# Altium project BIN_TO_BCD_MODULE.PrjPcb
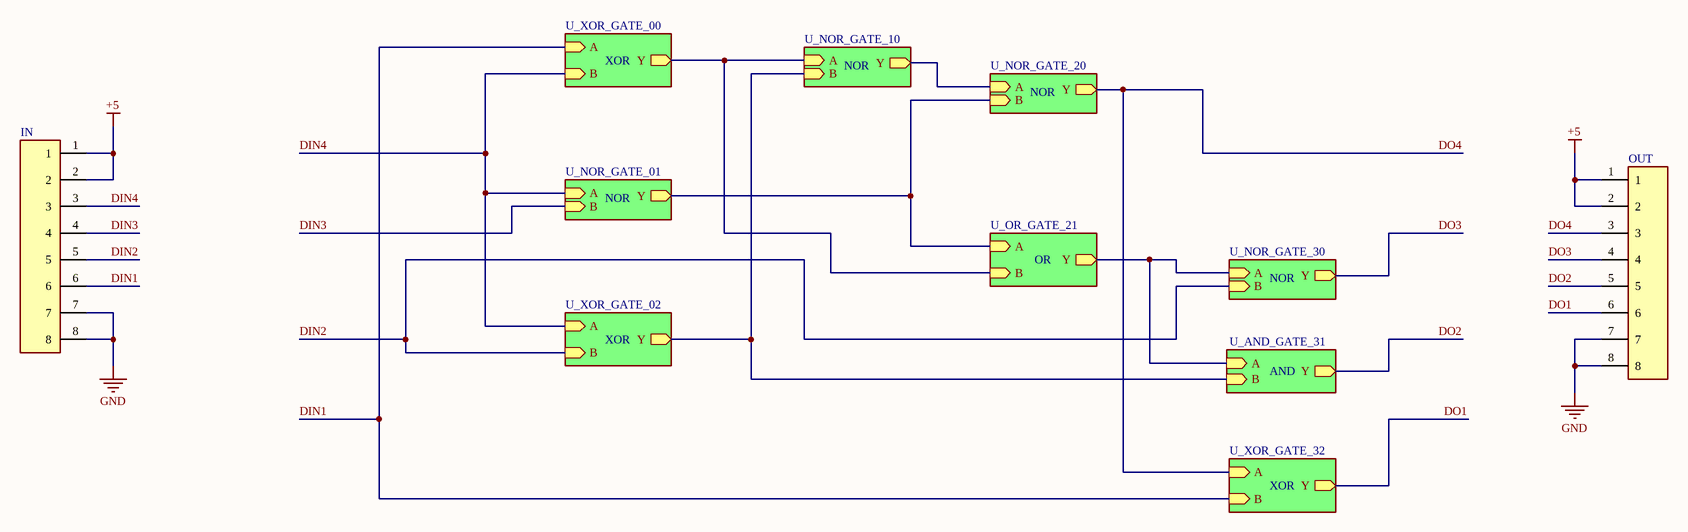
[diagram p0: MODULE_1.SchDoc]
6 sheets, 204 parts. Net scope: hierarchical (ports join the sheet entries above them; power ports are global).
Board files: PCB1.PcbDoc, PCB2.PcbDoc
Sheets:
  MODULE_1.SchDoc
    U_XOR_GATE_02 = XOR_GATE.SchDoc
    U_OR_GATE_21 = OR_GATE.SchDoc
    U_AND_GATE_31 = AND_GATE.SchDoc
    U_NOR_GATE_01 = NOR_GATE.SchDoc
    U_XOR_GATE_00 = XOR_GATE.SchDoc
    U_NOR_GATE_10 = NOR_GATE.SchDoc
    U_NOR_GATE_20 = NOR_GATE.SchDoc
    U_NOR_GATE_30 = NOR_GATE.SchDoc
    U_XOR_GATE_32 = XOR_GATE.SchDoc
  Sheet1.SchDoc

## Sheet MODULE_1.SchDoc
size B

### Parts
IN  2.54mm_TH_1x8_pin_header  [2.54mm_TH_1x8_pin_header]  (value not drawn)
OUT  2.54mm_TH_1x8_pin_header  [2.54mm_TH_1x8_pin_header]  (value not drawn)

### Sub-sheets
U_AND_GATE_31 = AND_GATE.SchDoc: Y (out), A (in), B (in)
U_NOR_GATE_01 = NOR_GATE.SchDoc: Y (out), A (in), B (in)
U_NOR_GATE_10 = NOR_GATE.SchDoc: Y (out), A (in), B (in)
U_NOR_GATE_20 = NOR_GATE.SchDoc: Y (out), A (in), B (in)
U_NOR_GATE_30 = NOR_GATE.SchDoc: Y (out), A (in), B (in)
U_OR_GATE_21 = OR_GATE.SchDoc: Y (out), A (in), B (in)
U_XOR_GATE_00 = XOR_GATE.SchDoc: Y (out), A (in), B (in)
U_XOR_GATE_02 = XOR_GATE.SchDoc: Y (out), A (in), B (in)
U_XOR_GATE_32 = XOR_GATE.SchDoc: Y (out), A (in), B (in)

### Nets
+5: IN.1 IN.2 OUT.1 OUT.2
GND: IN.7 IN.8 OUT.7 OUT.8
DIN1: IN.6 ; sheet U_XOR_GATE_00/A, sheet U_XOR_GATE_32/B
DIN2: IN.5 ; sheet U_XOR_GATE_02/B, sheet U_NOR_GATE_30/B
DIN3: IN.4 ; sheet U_NOR_GATE_01/B
DIN4: IN.3 ; sheet U_XOR_GATE_02/A, sheet U_NOR_GATE_01/A, sheet U_XOR_GATE_00/B
DO1: OUT.6 ; sheet U_XOR_GATE_32/Y
DO2: OUT.5 ; sheet U_AND_GATE_31/Y
DO3: OUT.4 ; sheet U_NOR_GATE_30/Y
DO4: OUT.3 ; sheet U_NOR_GATE_20/Y, sheet U_XOR_GATE_32/A
NetAIN_R1_2: sheet U_OR_GATE_21/Y, sheet U_AND_GATE_31/A, sheet U_NOR_GATE_30/A
NetAIN_R2_U_NOR_GATE_10_2: sheet U_OR_GATE_21/B, sheet U_XOR_GATE_00/Y, sheet U_NOR_GATE_10/A
NetAIN_R2_U_NOR_GATE_20_2: sheet U_NOR_GATE_10/Y, sheet U_NOR_GATE_20/A
NetAIN_R3_2: sheet U_OR_GATE_21/A, sheet U_NOR_GATE_01/Y, sheet U_NOR_GATE_20/B
NetBIN_R1_2: sheet U_XOR_GATE_02/Y, sheet U_AND_GATE_31/B, sheet U_NOR_GATE_10/B

### Notes on the sheet
- XOR
- NOR
- OR
- AND

### Library data of the parts
IN OUT = 2.54mm_TH_1x8_pin_header: System: Connector

## Sheet XOR_GATE.SchDoc
size A
Used 3 times, as channels U_XOR_GATE_02, U_XOR_GATE_00, U_XOR_GATE_32. Parts and nets are listed once, with the designators drawn on the sheet.
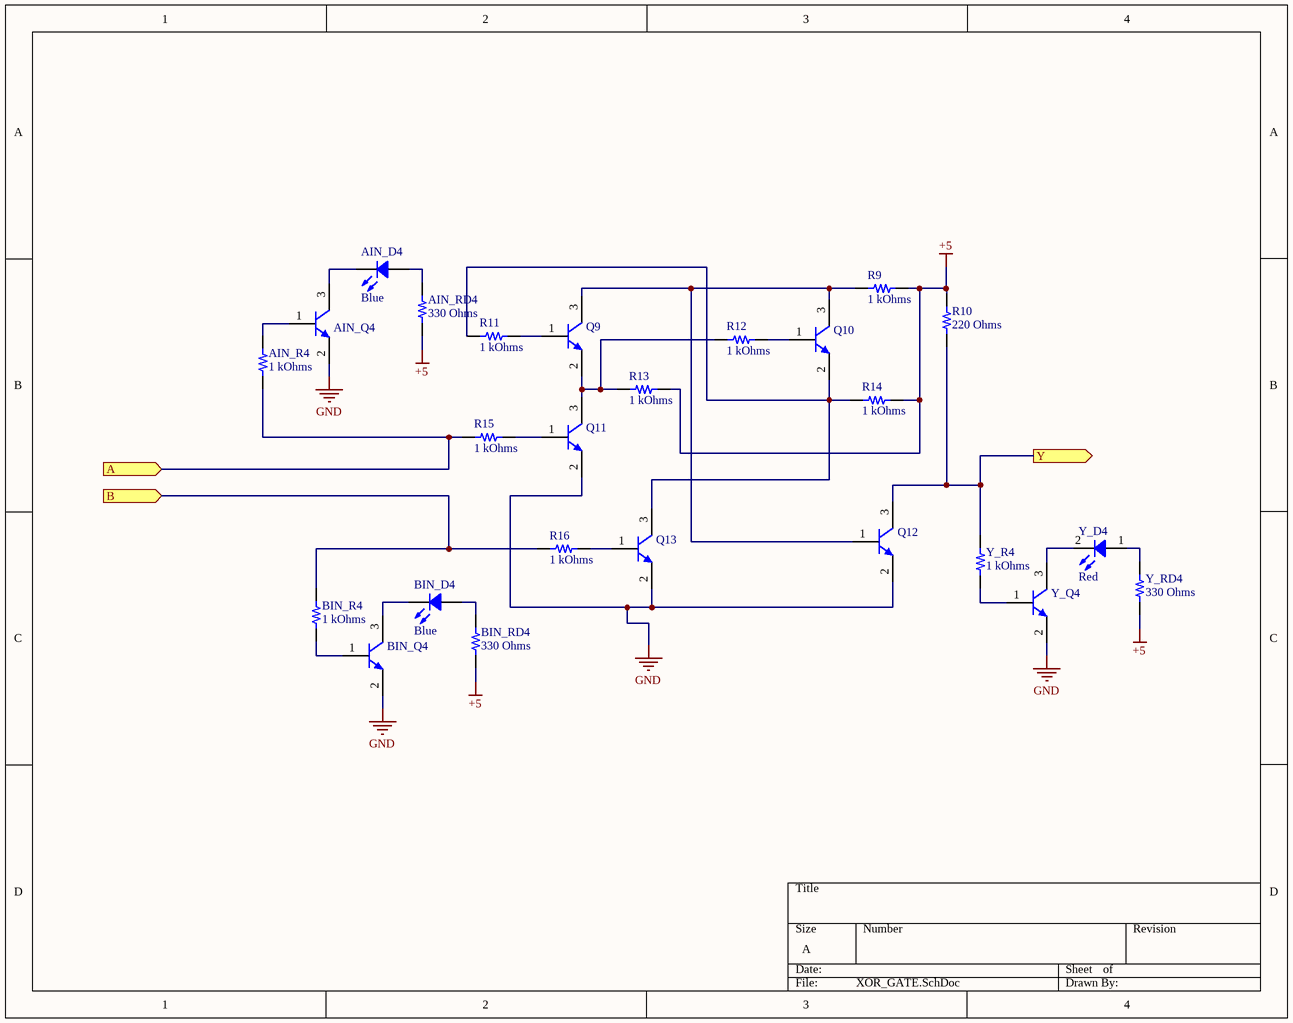
[diagram p1: XOR_GATE.SchDoc]

### Parts
AIN_D4  Blue  [LED 0603_1608 BLUE]
AIN_Q4  MMSS8050-L-TP  [MCCSEMI SOT-23-3]  (value not drawn)
AIN_R4  1 kOhms  [RES 0603_1608]
AIN_RD4  330 Ohms  [RES 0603_1608]
BIN_D4  Blue  [LED 0603_1608 BLUE]
BIN_Q4  MMSS8050-L-TP  [MCCSEMI SOT-23-3]  (value not drawn)
BIN_R4  1 kOhms  [RES 0603_1608]
BIN_RD4  330 Ohms  [RES 0603_1608]
Q9  MMSS8050-L-TP  [MCCSEMI SOT-23-3]  (value not drawn)
Q10  MMSS8050-L-TP  [MCCSEMI SOT-23-3]  (value not drawn)
Q11  MMSS8050-L-TP  [MCCSEMI SOT-23-3]  (value not drawn)
Q12  MMSS8050-L-TP  [MCCSEMI SOT-23-3]  (value not drawn)
Q13  MMSS8050-L-TP  [MCCSEMI SOT-23-3]  (value not drawn)
R9  1 kOhms  [RES 0603_1608]
R10  220 Ohms  [RES 0603_1608]
R11  1 kOhms  [RES 0603_1608]
R12  1 kOhms  [RES 0603_1608]
R13  1 kOhms  [RES 0603_1608]
R14  1 kOhms  [RES 0603_1608]
R15  1 kOhms  [RES 0603_1608]
R16  1 kOhms  [RES 0603_1608]
Y_D4  Red  [LED 0603_1608 RED]
Y_Q4  MMSS8050-L-TP  [MCCSEMI SOT-23-3]  (value not drawn)
Y_R4  1 kOhms  [RES 0603_1608]
Y_RD4  330 Ohms  [RES 0603_1608]

### Ports
A (in), B (in), Y (out)

### Nets
+5: AIN_RD4.1 BIN_RD4.1 R9.2 R10.2 R13.2 R14.2 Y_RD4.1
GND: AIN_Q4.2(E) BIN_Q4.2(E) Q11.2(E) Q12.2(E) Q13.2(E) Y_Q4.2(E)
A: AIN_R4.2 R15.1 ; port A
B: BIN_R4.2 R16.1 ; port B
Y: Q12.3(C) R10.1 Y_R4.2 ; port Y
NetAIN_D4_1: AIN_D4.1 AIN_RD4.2
NetAIN_D4_2: AIN_D4.2 AIN_Q4.3(C)
NetAIN_Q4_1: AIN_Q4.1(B) AIN_R4.1
NetBIN_D4_1: BIN_D4.1 BIN_RD4.2
NetBIN_D4_2: BIN_D4.2 BIN_Q4.3(C)
NetBIN_Q4_1: BIN_Q4.1(B) BIN_R4.1
NetQ9_1: Q9.1(B) R11.2
NetQ9_2: Q9.2(E) Q11.3(C) R12.1 R13.1
NetQ9_3: Q9.3(C) Q10.3(C) Q12.1(B) R9.1
NetQ10_1: Q10.1(B) R12.2
NetQ10_2: Q10.2(E) Q13.3(C) R11.1 R14.1
NetQ11_1: Q11.1(B) R15.2
NetQ13_1: Q13.1(B) R16.2
NetY_D4_1: Y_D4.1 Y_RD4.2
NetY_D4_2: Y_D4.2 Y_Q4.3(C)
NetY_Q4_1: Y_Q4.1(B) Y_R4.1

### Channels
U_XOR_GATE_02: designators end in _U_XOR_GATE_02; ports A=DIN4 B=DIN2 Y=NetBIN_R1_2
U_XOR_GATE_00: designators end in _U_XOR_GATE_00; ports A=DIN1 B=DIN4 Y=NetAIN_R2_U_NOR_GATE_10_2
U_XOR_GATE_32: designators end in _U_XOR_GATE_32; ports A=DO4 B=DIN1 Y=DO1

### Library data of the parts
AIN_D4 BIN_D4 = IN-S63AT5B: LED BLUE CLEAR 0603 SMD; Manufacturer: Inolux; Configuration: Standard; Current - Test: 5mA; Lens Size: 1.15mm x 0.80mm; Lens Style: Rectangle with Flat Top; Millicandela Rating: 45mcd; Viewing Angle: 120°; Voltage - Forward (Vf) (Typ): 2.8V; Wavelength - Dominant: 470nm; Wavelength - Peak: 468nm; Part Number: IN-S63AT5B; Color: Blue; ComponentLink1Description: Datasheet; ComponentLink1URL: http://www.inolux-corp.com/datasheet/SMDLED/Mono%20Color%20Top%20View/IN-S63AT%20Series_V1.1.pdf; ComponentLink2Description: DigiKey Link; ComponentLink2URL: https://www.digikey.com/en/products/detail/inolux/IN-S63AT5B/7604929; Device Package: 0603 (1608 Metric); Height (Max): 0.40mm; LastUpdated: 6/3/2024 7:57:52 PM; Lens Color: Clear; Lens Transparency: Clear; Lifecycle Status: Active; Minimum Order: 1; Mounting Type: Surface Mount; Package / Case: 0603 (1608 Metric); Packaging: TapeAndReel; PartId: 834; Part Status: Active; Price: 0.03; Series: IN-S63AT; Size / Dimension: 1.60mm L x 0.80mm W; Supplier 1: DigiKey; Supplier Part Number 1: 1830-1061-1-ND; Supplier Device Package: 0603; Value: Blue
AIN_Q4 BIN_Q4 Q9-Q13 Y_Q4 = MMSS8050-L-TP: TRANS NPN 25V 1.5A SOT23; Manufacturer: Micro Commercial Co; Current - Collector Cutoff (Max): 100nA; DC Current Gain (hFE) (Min) @ Ic, Vce: 120 @ 100mA, 1V; Frequency - Transition: 100MHz; Power - Max: 625 mW; Vce Saturation (Max) @ Ib, Ic: 500mV @ 80mA, 800mA; Part Number: MMSS8050-L-TP; ComponentLink1Description: Datasheet; ComponentLink1URL: https://www.mccsemi.com/pdf/Products/MMSS8050(SOT-23).pdf; ComponentLink2Description: DigiKey Link; ComponentLink2URL: https://www.digikey.com/en/products/detail/micro-commercial-co/MMSS8050-L-TP/2827197; Current - Collector (Ic) (Max): 1.5 A; LastUpdated: 6/3/2024 8:24:16 PM; Lifecycle Status: Active; Minimum Order: 1; Mounting Type: Surface Mount; Operating Temperature: -55°C ~ 150°C (TJ); Package / Case: TO-236-3, SC-59, SOT-23-3; Packaging: TapeAndReel; PartId: 278; Part Status: Active; Price: 0.01; Series: -; Supplier 1: DigiKey; Supplier Part Number 1: MMSS8050-L-TPMSCT-ND; Supplier Device Package: SOT-23; Transistor Type: NPN; Voltage - Collector Emitter Breakdown (Max): 25 V
AIN_R4 BIN_R4 R9 R11-R16 Y_R4 = CPF0603B1K0E: RES SMD 1K OHM 0.1% 1/16W 0603; Manufacturer: TE Connectivity Passive Product; Power (Watts): 0.063W, 1/16W; Temperature Coefficient: ±25ppm/°C; Part Number: CPF0603B1K0E; Value: 1 kOhms; ComponentLink1Description: Datasheet; ComponentLink1URL: https://www.te.com/commerce/DocumentDelivery/DDEController?Action=srchrtrv&DocNm=1773200&DocType=DS&DocLang=English; ComponentLink2Description: DigiKey Link; ComponentLink2URL: https://www.digikey.com/en/products/detail/te-connectivity-passive-product/CPF0603B1K0E/2390473; Composition: Thin Film; Device Package: 0603 (1608 Metric); Height - Seated (Max): 0.022" (0.55mm); LastUpdated: 2/9/2024 8:43:37 PM; Lifecycle Status: Active; Minimum Order: 1; Number of Terminations: 2; Operating Temperature: -55°C ~ 155°C; Package / Case: 0603 (1608 Metric); Packaging: TapeAndReel; PartId: 4877; Part Status: Active; Price: 0.09; Resistance: 1 kOhms; Series: CPF, Neohm; Size / Dimension: 0.061" L x 0.031" W (1.55mm x 0.80mm); Supplier 1: DigiKey; Supplier Part Number 1: A119887CT-ND; Supplier Device Package: 0603; Tolerance: ±0.1%
AIN_RD4 BIN_RD4 Y_RD4 = RMCF0603JT330R: RES 330 OHM 5% 1/10W 0603; Manufacturer: Stackpole Electronics Inc; Power (Watts): 0.1W, 1/10W; Temperature Coefficient: ±200ppm/°C; Part Number: RMCF0603JT330R; Value: 330 Ohms; ComponentLink1Description: Datasheet; ComponentLink1URL: https://www.seielect.com/catalog/sei-rmcf_rmcp.pdf; ComponentLink2Description: DigiKey Link; ComponentLink2URL: https://www.digikey.com/en/products/detail/stackpole-electronics-inc/RMCF0603JT330R/1757998; Composition: Thick Film; Device Package: 0603 (1608 Metric); Features: Automotive AEC-Q200; Height - Seated (Max): 0.022" (0.55mm); LastUpdated: 2/9/2024 8:43:33 PM; Lifecycle Status: Active; Minimum Order: 1; Number of Terminations: 2; Operating Temperature: -55°C ~ 155°C; Package / Case: 0603 (1608 Metric); Packaging: CutTape; PartId: 5841; Part Status: Active; Price: 0.01; Ratings: AEC-Q200; Resistance: 330 Ohms; Series: RMCF; Size / Dimension: 0.061" L x 0.031" W (1.55mm x 0.80mm); Supplier 1: DigiKey; Supplier Part Number 1: RMCF0603JT330RCT-ND; Supplier Device Package: 0603; Tolerance: ±5%
R10 = ERA-3AED221V: RES SMD 220 OHM 0.5% 1/10W 0603; Manufacturer: Panasonic Electronic Components; Power (Watts): 0.1W, 1/10W; Temperature Coefficient: ±25ppm/°C; Part Number: ERA-3AED221V; Value: 220 Ohms; ComponentLink1Description: Datasheet; ComponentLink1URL: https://industrial.panasonic.com/cdbs/www-data/pdf/RDM0000/AOA0000C307.pdf; ComponentLink2Description: DigiKey Link; ComponentLink2URL: https://www.digikey.com/en/products/detail/panasonic-electronic-components/ERA-3AED221V/9373509; Composition: Thin Film; Device Package: 0603 (1608 Metric); Features: Automotive AEC-Q200; Height - Seated (Max): 0.022" (0.55mm); LastUpdated: 2/9/2024 8:43:36 PM; Lifecycle Status: Active; Minimum Order: 1; Number of Terminations: 2; Operating Temperature: -55°C ~ 155°C; Package / Case: 0603 (1608 Metric); Packaging: TapeAndReel; PartId: 4952; Part Status: Active; Price: 0.03; Ratings: AEC-Q200; Resistance: 220 Ohms; Series: ERA-3A; Size / Dimension: 0.063" L x 0.031" W (1.60mm x 0.80mm); Supplier 1: DigiKey; Supplier Part Number 1: P123752CT-ND; Supplier Device Package: 0603; Tolerance: ±0.5%
Y_D4 = XZMDK53W-8: LED RED CLEAR CHIP SMD; Manufacturer: SunLED; Configuration: Standard; Current - Test: 20mA; Lens Color: Colorless; Lens Size: 0.35mm Dia; Lens Style: Round with Domed Top; Millicandela Rating: 248mcd; Viewing Angle: 60°; Voltage - Forward (Vf) (Typ): 1.95V; Wavelength - Dominant: 630nm; Wavelength - Peak: 645nm; Part Number: XZMDK53W-8; Color: Red; ComponentLink1Description: Datasheet; ComponentLink1URL: https://www.sunledusa.com/products/spec/XZMDK53W-8.pdf; ComponentLink2Description: DigiKey Link; ComponentLink2URL: https://www.digikey.com/en/products/detail/sunled/XZMDK53W-8/4745952; Device Package: 0603 (1608 Metric); Height (Max): 0.95mm; LastUpdated: 6/3/2024 7:59:48 PM; Lens Transparency: Clear; Lifecycle Status: Active; Minimum Order: 1; Mounting Type: Surface Mount; Package / Case: 0603 (1608 Metric); Packaging: TapeAndReel; PartId: 401; Part Status: Active; Price: 0.06; Series: PixsoLED; Size / Dimension: 1.60mm L x 0.80mm W; Supplier 1: DigiKey; Supplier Part Number 1: 1497-1169-6-ND; Supplier Device Package: Chip LED; Value: Red

## Sheet OR_GATE.SchDoc
size A
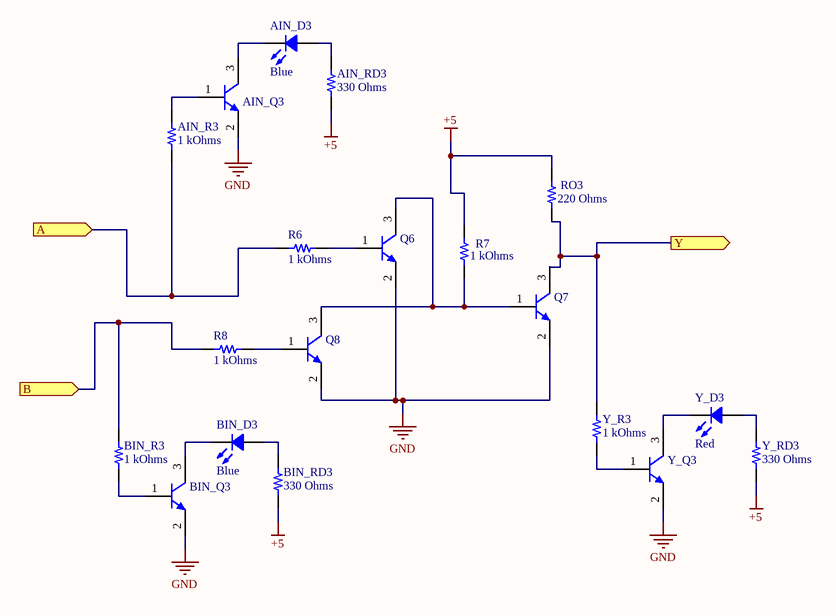
[diagram p2: OR_GATE.SchDoc]

### Parts
AIN_D3  Blue  [LED 0603_1608 BLUE]
AIN_Q3  MMSS8050-L-TP  [MCCSEMI SOT-23-3]  (value not drawn)
AIN_R3  1 kOhms  [RES 0603_1608]
AIN_RD3  330 Ohms  [RES 0603_1608]
BIN_D3  Blue  [LED 0603_1608 BLUE]
BIN_Q3  MMSS8050-L-TP  [MCCSEMI SOT-23-3]  (value not drawn)
BIN_R3  1 kOhms  [RES 0603_1608]
BIN_RD3  330 Ohms  [RES 0603_1608]
Q6  MMSS8050-L-TP  [MCCSEMI SOT-23-3]  (value not drawn)
Q7  MMSS8050-L-TP  [MCCSEMI SOT-23-3]  (value not drawn)
Q8  MMSS8050-L-TP  [MCCSEMI SOT-23-3]  (value not drawn)
R6  1 kOhms  [RES 0603_1608]
R7  1 kOhms  [RES 0603_1608]
R8  1 kOhms  [RES 0603_1608]
RO3  220 Ohms  [RES 0603_1608]
Y_D3  Red  [LED 0603_1608 RED]
Y_Q3  MMSS8050-L-TP  [MCCSEMI SOT-23-3]  (value not drawn)
Y_R3  1 kOhms  [RES 0603_1608]
Y_RD3  330 Ohms  [RES 0603_1608]

### Ports
A (in), B (in), Y (out)

### Nets
+5: AIN_RD3.1 BIN_RD3.1 R7.2 RO3.2 Y_RD3.1
GND: AIN_Q3.2(E) BIN_Q3.2(E) Q6.2(E) Q7.2(E) Q8.2(E) Y_Q3.2(E)
NetAIN_D3_1: AIN_D3.1 AIN_RD3.2
NetAIN_D3_2: AIN_D3.2 AIN_Q3.3(C)
NetAIN_Q3_1: AIN_Q3.1(B) AIN_R3.1
NetAIN_R1_2: Q7.3(C) RO3.1 Y_R3.2 ; port Y
NetAIN_R2_U_NOR_GATE_10_2: BIN_R3.2 R8.1 ; port B
NetAIN_R3_2: AIN_R3.2 R6.1 ; port A
NetBIN_D3_1: BIN_D3.1 BIN_RD3.2
NetBIN_D3_2: BIN_D3.2 BIN_Q3.3(C)
NetBIN_Q3_1: BIN_Q3.1(B) BIN_R3.1
NetQ6_1: Q6.1(B) R6.2
NetQ6_3: Q6.3(C) Q7.1(B) Q8.3(C) R7.1
NetQ8_1: Q8.1(B) R8.2
NetY_D3_1: Y_D3.1 Y_RD3.2
NetY_D3_2: Y_D3.2 Y_Q3.3(C)
NetY_Q3_1: Y_Q3.1(B) Y_R3.1

### Library data of the parts
AIN_D3 BIN_D3 = IN-S63AT5B: as AIN_D4 on sheet XOR_GATE; Part Number: IN-S63AT5B; Color: Blue; ComponentLink1Description: Datasheet; ComponentLink1URL: http://www.inolux-corp.com/datasheet/SMDLED/Mono%20Color%20Top%20View/IN-S63AT%20Series_V1.1.pdf; ComponentLink2Description: DigiKey Link; ComponentLink2URL: https://www.digikey.com/en/products/detail/inolux/IN-S63AT5B/7604929; Device Package: 0603 (1608 Metric); Height (Max): 0.40mm; LastUpdated: 6/3/2024 7:57:52 PM; Lens Color: Clear; Lens Transparency: Clear; Lifecycle Status: Active; Minimum Order: 1; Mounting Type: Surface Mount; Package / Case: 0603 (1608 Metric); Packaging: TapeAndReel; PartId: 834; Part Status: Active; Price: 0.03; Series: IN-S63AT; Size / Dimension: 1.60mm L x 0.80mm W; Supplier 1: DigiKey; Supplier Part Number 1: 1830-1061-1-ND; Supplier Device Package: 0603; Value: Blue
AIN_Q3 BIN_Q3 Q6-Q8 Y_Q3 = MMSS8050-L-TP: as AIN_Q4 on sheet XOR_GATE; Part Number: MMSS8050-L-TP; ComponentLink1Description: Datasheet; ComponentLink1URL: https://www.mccsemi.com/pdf/Products/MMSS8050(SOT-23).pdf; ComponentLink2Description: DigiKey Link; ComponentLink2URL: https://www.digikey.com/en/products/detail/micro-commercial-co/MMSS8050-L-TP/2827197; Current - Collector (Ic) (Max): 1.5 A; LastUpdated: 6/3/2024 8:24:16 PM; Lifecycle Status: Active; Minimum Order: 1; Mounting Type: Surface Mount; Operating Temperature: -55°C ~ 150°C (TJ); Package / Case: TO-236-3, SC-59, SOT-23-3; Packaging: TapeAndReel; PartId: 278; Part Status: Active; Price: 0.01; Series: -; Supplier 1: DigiKey; Supplier Part Number 1: MMSS8050-L-TPMSCT-ND; Supplier Device Package: SOT-23; Transistor Type: NPN; Voltage - Collector Emitter Breakdown (Max): 25 V
AIN_R3 BIN_R3 R6-R8 Y_R3 = CPF0603B1K0E: as AIN_R4 on sheet XOR_GATE; Part Number: CPF0603B1K0E; Value: 1 kOhms; ComponentLink1Description: Datasheet; ComponentLink1URL: https://www.te.com/commerce/DocumentDelivery/DDEController?Action=srchrtrv&DocNm=1773200&DocType=DS&DocLang=English; ComponentLink2Description: DigiKey Link; ComponentLink2URL: https://www.digikey.com/en/products/detail/te-connectivity-passive-product/CPF0603B1K0E/2390473; Composition: Thin Film; Device Package: 0603 (1608 Metric); Height - Seated (Max): 0.022" (0.55mm); LastUpdated: 2/9/2024 8:43:37 PM; Lifecycle Status: Active; Minimum Order: 1; Number of Terminations: 2; Operating Temperature: -55°C ~ 155°C; Package / Case: 0603 (1608 Metric); Packaging: TapeAndReel; PartId: 4877; Part Status: Active; Price: 0.09; Resistance: 1 kOhms; Series: CPF, Neohm; Size / Dimension: 0.061" L x 0.031" W (1.55mm x 0.80mm); Supplier 1: DigiKey; Supplier Part Number 1: A119887CT-ND; Supplier Device Package: 0603; Tolerance: ±0.1%
AIN_RD3 BIN_RD3 Y_RD3 = RMCF0603JT330R: as AIN_RD4 on sheet XOR_GATE; Part Number: RMCF0603JT330R; Value: 330 Ohms; ComponentLink1Description: Datasheet; ComponentLink1URL: https://www.seielect.com/catalog/sei-rmcf_rmcp.pdf; ComponentLink2Description: DigiKey Link; ComponentLink2URL: https://www.digikey.com/en/products/detail/stackpole-electronics-inc/RMCF0603JT330R/1757998; Composition: Thick Film; Device Package: 0603 (1608 Metric); Features: Automotive AEC-Q200; Height - Seated (Max): 0.022" (0.55mm); LastUpdated: 2/9/2024 8:43:33 PM; Lifecycle Status: Active; Minimum Order: 1; Number of Terminations: 2; Operating Temperature: -55°C ~ 155°C; Package / Case: 0603 (1608 Metric); Packaging: CutTape; PartId: 5841; Part Status: Active; Price: 0.01; Ratings: AEC-Q200; Resistance: 330 Ohms; Series: RMCF; Size / Dimension: 0.061" L x 0.031" W (1.55mm x 0.80mm); Supplier 1: DigiKey; Supplier Part Number 1: RMCF0603JT330RCT-ND; Supplier Device Package: 0603; Tolerance: ±5%
RO3 = ERA-3AED221V: as R10 on sheet XOR_GATE; Part Number: ERA-3AED221V; Value: 220 Ohms; ComponentLink1Description: Datasheet; ComponentLink1URL: https://industrial.panasonic.com/cdbs/www-data/pdf/RDM0000/AOA0000C307.pdf; ComponentLink2Description: DigiKey Link; ComponentLink2URL: https://www.digikey.com/en/products/detail/panasonic-electronic-components/ERA-3AED221V/9373509; Composition: Thin Film; Device Package: 0603 (1608 Metric); Features: Automotive AEC-Q200; Height - Seated (Max): 0.022" (0.55mm); LastUpdated: 2/9/2024 8:43:36 PM; Lifecycle Status: Active; Minimum Order: 1; Number of Terminations: 2; Operating Temperature: -55°C ~ 155°C; Package / Case: 0603 (1608 Metric); Packaging: TapeAndReel; PartId: 4952; Part Status: Active; Price: 0.03; Ratings: AEC-Q200; Resistance: 220 Ohms; Series: ERA-3A; Size / Dimension: 0.063" L x 0.031" W (1.60mm x 0.80mm); Supplier 1: DigiKey; Supplier Part Number 1: P123752CT-ND; Supplier Device Package: 0603; Tolerance: ±0.5%
Y_D3 = XZMDK53W-8: as Y_D4 on sheet XOR_GATE; Part Number: XZMDK53W-8; Color: Red; ComponentLink1Description: Datasheet; ComponentLink1URL: https://www.sunledusa.com/products/spec/XZMDK53W-8.pdf; ComponentLink2Description: DigiKey Link; ComponentLink2URL: https://www.digikey.com/en/products/detail/sunled/XZMDK53W-8/4745952; Device Package: 0603 (1608 Metric); Height (Max): 0.95mm; LastUpdated: 6/3/2024 7:59:48 PM; Lens Transparency: Clear; Lifecycle Status: Active; Minimum Order: 1; Mounting Type: Surface Mount; Package / Case: 0603 (1608 Metric); Packaging: TapeAndReel; PartId: 401; Part Status: Active; Price: 0.06; Series: PixsoLED; Size / Dimension: 1.60mm L x 0.80mm W; Supplier 1: DigiKey; Supplier Part Number 1: 1497-1169-6-ND; Supplier Device Package: Chip LED; Value: Red

## Sheet AND_GATE.SchDoc
size A
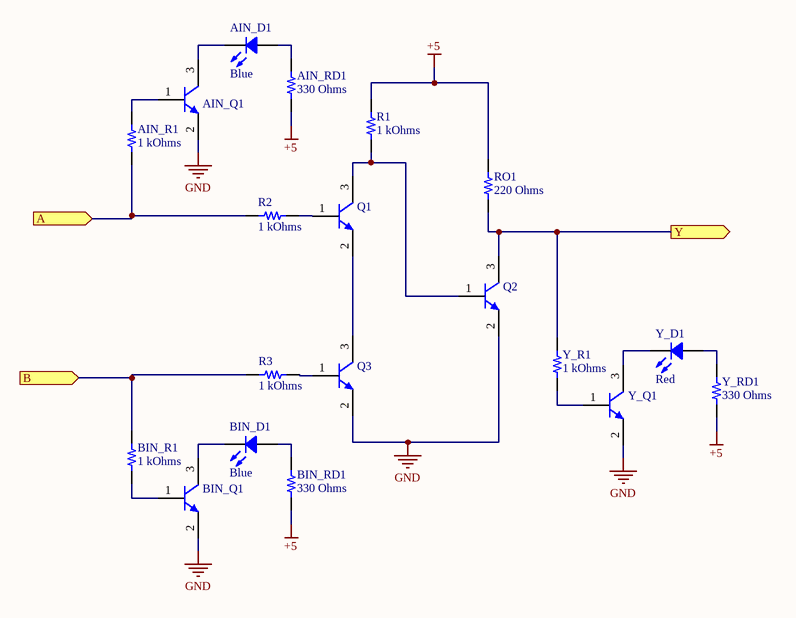
[diagram p3: AND_GATE.SchDoc]

### Parts
AIN_D1  Blue  [LED 0603_1608 BLUE]
AIN_Q1  MMSS8050-L-TP  [MCCSEMI SOT-23-3]  (value not drawn)
AIN_R1  1 kOhms  [RES 0603_1608]
AIN_RD1  330 Ohms  [RES 0603_1608]
BIN_D1  Blue  [LED 0603_1608 BLUE]
BIN_Q1  MMSS8050-L-TP  [MCCSEMI SOT-23-3]  (value not drawn)
BIN_R1  1 kOhms  [RES 0603_1608]
BIN_RD1  330 Ohms  [RES 0603_1608]
Q1  MMSS8050-L-TP  [MCCSEMI SOT-23-3]  (value not drawn)
Q2  MMSS8050-L-TP  [MCCSEMI SOT-23-3]  (value not drawn)
Q3  MMSS8050-L-TP  [MCCSEMI SOT-23-3]  (value not drawn)
R1  1 kOhms  [RES 0603_1608]
R2  1 kOhms  [RES 0603_1608]
R3  1 kOhms  [RES 0603_1608]
RO1  220 Ohms  [RES 0603_1608]
Y_D1  Red  [LED 0603_1608 RED]
Y_Q1  MMSS8050-L-TP  [MCCSEMI SOT-23-3]  (value not drawn)
Y_R1  1 kOhms  [RES 0603_1608]
Y_RD1  330 Ohms  [RES 0603_1608]

### Ports
A (in), B (in), Y (out)

### Nets
+5: AIN_RD1.1 BIN_RD1.1 R1.2 RO1.2 Y_RD1.1
GND: AIN_Q1.2(E) BIN_Q1.2(E) Q2.2(E) Q3.2(E) Y_Q1.2(E)
DO2: Q2.3(C) RO1.1 Y_R1.2 ; port Y
NetAIN_D1_1: AIN_D1.1 AIN_RD1.2
NetAIN_D1_2: AIN_D1.2 AIN_Q1.3(C)
NetAIN_Q1_1: AIN_Q1.1(B) AIN_R1.1
NetAIN_R1_2: AIN_R1.2 R2.1 ; port A
NetBIN_D1_1: BIN_D1.1 BIN_RD1.2
NetBIN_D1_2: BIN_D1.2 BIN_Q1.3(C)
NetBIN_Q1_1: BIN_Q1.1(B) BIN_R1.1
NetBIN_R1_2: BIN_R1.2 R3.1 ; port B
NetQ1_1: Q1.1(B) R2.2
NetQ1_2: Q1.2(E) Q3.3(C)
NetQ1_3: Q1.3(C) Q2.1(B) R1.1
NetQ3_1: Q3.1(B) R3.2
NetY_D1_1: Y_D1.1 Y_RD1.2
NetY_D1_2: Y_D1.2 Y_Q1.3(C)
NetY_Q1_1: Y_Q1.1(B) Y_R1.1

### Library data of the parts
AIN_D1 BIN_D1 = IN-S63AT5B: as AIN_D4 on sheet XOR_GATE; Part Number: IN-S63AT5B; Color: Blue; ComponentLink1Description: Datasheet; ComponentLink1URL: http://www.inolux-corp.com/datasheet/SMDLED/Mono%20Color%20Top%20View/IN-S63AT%20Series_V1.1.pdf; ComponentLink2Description: DigiKey Link; ComponentLink2URL: https://www.digikey.com/en/products/detail/inolux/IN-S63AT5B/7604929; Device Package: 0603 (1608 Metric); Height (Max): 0.40mm; LastUpdated: 6/3/2024 7:57:52 PM; Lens Color: Clear; Lens Transparency: Clear; Lifecycle Status: Active; Minimum Order: 1; Mounting Type: Surface Mount; Package / Case: 0603 (1608 Metric); Packaging: TapeAndReel; PartId: 834; Part Status: Active; Price: 0.03; Series: IN-S63AT; Size / Dimension: 1.60mm L x 0.80mm W; Supplier 1: DigiKey; Supplier Part Number 1: 1830-1061-1-ND; Supplier Device Package: 0603; Value: Blue
AIN_Q1 BIN_Q1 Q1-Q3 Y_Q1 = MMSS8050-L-TP: as AIN_Q4 on sheet XOR_GATE; Part Number: MMSS8050-L-TP; ComponentLink1Description: Datasheet; ComponentLink1URL: https://www.mccsemi.com/pdf/Products/MMSS8050(SOT-23).pdf; ComponentLink2Description: DigiKey Link; ComponentLink2URL: https://www.digikey.com/en/products/detail/micro-commercial-co/MMSS8050-L-TP/2827197; Current - Collector (Ic) (Max): 1.5 A; LastUpdated: 6/3/2024 8:24:16 PM; Lifecycle Status: Active; Minimum Order: 1; Mounting Type: Surface Mount; Operating Temperature: -55°C ~ 150°C (TJ); Package / Case: TO-236-3, SC-59, SOT-23-3; Packaging: TapeAndReel; PartId: 278; Part Status: Active; Price: 0.01; Series: -; Supplier 1: DigiKey; Supplier Part Number 1: MMSS8050-L-TPMSCT-ND; Supplier Device Package: SOT-23; Transistor Type: NPN; Voltage - Collector Emitter Breakdown (Max): 25 V
AIN_R1 BIN_R1 R1-R3 Y_R1 = CPF0603B1K0E: as AIN_R4 on sheet XOR_GATE; Part Number: CPF0603B1K0E; Value: 1 kOhms; ComponentLink1Description: Datasheet; ComponentLink1URL: https://www.te.com/commerce/DocumentDelivery/DDEController?Action=srchrtrv&DocNm=1773200&DocType=DS&DocLang=English; ComponentLink2Description: DigiKey Link; ComponentLink2URL: https://www.digikey.com/en/products/detail/te-connectivity-passive-product/CPF0603B1K0E/2390473; Composition: Thin Film; Device Package: 0603 (1608 Metric); Height - Seated (Max): 0.022" (0.55mm); LastUpdated: 2/9/2024 8:43:37 PM; Lifecycle Status: Active; Minimum Order: 1; Number of Terminations: 2; Operating Temperature: -55°C ~ 155°C; Package / Case: 0603 (1608 Metric); Packaging: TapeAndReel; PartId: 4877; Part Status: Active; Price: 0.09; Resistance: 1 kOhms; Series: CPF, Neohm; Size / Dimension: 0.061" L x 0.031" W (1.55mm x 0.80mm); Supplier 1: DigiKey; Supplier Part Number 1: A119887CT-ND; Supplier Device Package: 0603; Tolerance: ±0.1%
AIN_RD1 BIN_RD1 Y_RD1 = RMCF0603JT330R: as AIN_RD4 on sheet XOR_GATE; Part Number: RMCF0603JT330R; Value: 330 Ohms; ComponentLink1Description: Datasheet; ComponentLink1URL: https://www.seielect.com/catalog/sei-rmcf_rmcp.pdf; ComponentLink2Description: DigiKey Link; ComponentLink2URL: https://www.digikey.com/en/products/detail/stackpole-electronics-inc/RMCF0603JT330R/1757998; Composition: Thick Film; Device Package: 0603 (1608 Metric); Features: Automotive AEC-Q200; Height - Seated (Max): 0.022" (0.55mm); LastUpdated: 2/9/2024 8:43:33 PM; Lifecycle Status: Active; Minimum Order: 1; Number of Terminations: 2; Operating Temperature: -55°C ~ 155°C; Package / Case: 0603 (1608 Metric); Packaging: CutTape; PartId: 5841; Part Status: Active; Price: 0.01; Ratings: AEC-Q200; Resistance: 330 Ohms; Series: RMCF; Size / Dimension: 0.061" L x 0.031" W (1.55mm x 0.80mm); Supplier 1: DigiKey; Supplier Part Number 1: RMCF0603JT330RCT-ND; Supplier Device Package: 0603; Tolerance: ±5%
RO1 = ERA-3AED221V: as R10 on sheet XOR_GATE; Part Number: ERA-3AED221V; Value: 220 Ohms; ComponentLink1Description: Datasheet; ComponentLink1URL: https://industrial.panasonic.com/cdbs/www-data/pdf/RDM0000/AOA0000C307.pdf; ComponentLink2Description: DigiKey Link; ComponentLink2URL: https://www.digikey.com/en/products/detail/panasonic-electronic-components/ERA-3AED221V/9373509; Composition: Thin Film; Device Package: 0603 (1608 Metric); Features: Automotive AEC-Q200; Height - Seated (Max): 0.022" (0.55mm); LastUpdated: 2/9/2024 8:43:36 PM; Lifecycle Status: Active; Minimum Order: 1; Number of Terminations: 2; Operating Temperature: -55°C ~ 155°C; Package / Case: 0603 (1608 Metric); Packaging: TapeAndReel; PartId: 4952; Part Status: Active; Price: 0.03; Ratings: AEC-Q200; Resistance: 220 Ohms; Series: ERA-3A; Size / Dimension: 0.063" L x 0.031" W (1.60mm x 0.80mm); Supplier 1: DigiKey; Supplier Part Number 1: P123752CT-ND; Supplier Device Package: 0603; Tolerance: ±0.5%
Y_D1 = XZMDK53W-8: as Y_D4 on sheet XOR_GATE; Part Number: XZMDK53W-8; Color: Red; ComponentLink1Description: Datasheet; ComponentLink1URL: https://www.sunledusa.com/products/spec/XZMDK53W-8.pdf; ComponentLink2Description: DigiKey Link; ComponentLink2URL: https://www.digikey.com/en/products/detail/sunled/XZMDK53W-8/4745952; Device Package: 0603 (1608 Metric); Height (Max): 0.95mm; LastUpdated: 6/3/2024 7:59:48 PM; Lens Transparency: Clear; Lifecycle Status: Active; Minimum Order: 1; Mounting Type: Surface Mount; Package / Case: 0603 (1608 Metric); Packaging: TapeAndReel; PartId: 401; Part Status: Active; Price: 0.06; Series: PixsoLED; Size / Dimension: 1.60mm L x 0.80mm W; Supplier 1: DigiKey; Supplier Part Number 1: 1497-1169-6-ND; Supplier Device Package: Chip LED; Value: Red

## Sheet NOR_GATE.SchDoc
size A
Used 4 times, as channels U_NOR_GATE_01, U_NOR_GATE_10, U_NOR_GATE_20, U_NOR_GATE_30. Parts and nets are listed once, with the designators drawn on the sheet.
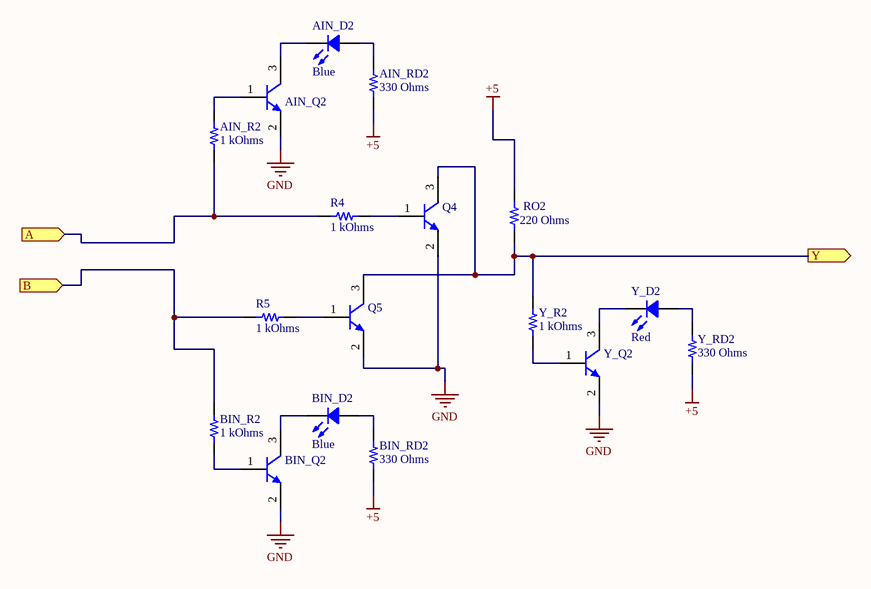
[diagram p4: NOR_GATE.SchDoc]

### Parts
AIN_D2  Blue  [LED 0603_1608 BLUE]
AIN_Q2  MMSS8050-L-TP  [MCCSEMI SOT-23-3]  (value not drawn)
AIN_R2  1 kOhms  [RES 0603_1608]
AIN_RD2  330 Ohms  [RES 0603_1608]
BIN_D2  Blue  [LED 0603_1608 BLUE]
BIN_Q2  MMSS8050-L-TP  [MCCSEMI SOT-23-3]  (value not drawn)
BIN_R2  1 kOhms  [RES 0603_1608]
BIN_RD2  330 Ohms  [RES 0603_1608]
Q4  MMSS8050-L-TP  [MCCSEMI SOT-23-3]  (value not drawn)
Q5  MMSS8050-L-TP  [MCCSEMI SOT-23-3]  (value not drawn)
R4  1 kOhms  [RES 0603_1608]
R5  1 kOhms  [RES 0603_1608]
RO2  220 Ohms  [RES 0603_1608]
Y_D2  Red  [LED 0603_1608 RED]
Y_Q2  MMSS8050-L-TP  [MCCSEMI SOT-23-3]  (value not drawn)
Y_R2  1 kOhms  [RES 0603_1608]
Y_RD2  330 Ohms  [RES 0603_1608]

### Ports
A (in), B (in), Y (out)

### Nets
+5: AIN_RD2.1 BIN_RD2.1 RO2.2 Y_RD2.1
GND: AIN_Q2.2(E) BIN_Q2.2(E) Q4.2(E) Q5.2(E) Y_Q2.2(E)
A: AIN_R2.2 R4.1 ; port A
B: BIN_R2.2 R5.1 ; port B
Y: Q4.3(C) Q5.3(C) RO2.1 Y_R2.2 ; port Y
NetAIN_D2_1: AIN_D2.1 AIN_RD2.2
NetAIN_D2_2: AIN_D2.2 AIN_Q2.3(C)
NetAIN_Q2_1: AIN_Q2.1(B) AIN_R2.1
NetBIN_D2_1: BIN_D2.1 BIN_RD2.2
NetBIN_D2_2: BIN_D2.2 BIN_Q2.3(C)
NetBIN_Q2_1: BIN_Q2.1(B) BIN_R2.1
NetQ4_1: Q4.1(B) R4.2
NetQ5_1: Q5.1(B) R5.2
NetY_D2_1: Y_D2.1 Y_RD2.2
NetY_D2_2: Y_D2.2 Y_Q2.3(C)
NetY_Q2_1: Y_Q2.1(B) Y_R2.1

### Channels
U_NOR_GATE_01: designators end in _U_NOR_GATE_01; ports A=DIN4 B=DIN3 Y=NetAIN_R3_2
U_NOR_GATE_10: designators end in _U_NOR_GATE_10; ports A=NetAIN_R2_U_NOR_GATE_10_2 B=NetBIN_R1_2 Y=NetAIN_R2_U_NOR_GATE_20_2
U_NOR_GATE_20: designators end in _U_NOR_GATE_20; ports A=NetAIN_R2_U_NOR_GATE_20_2 B=NetAIN_R3_2 Y=DO4
U_NOR_GATE_30: designators end in _U_NOR_GATE_30; ports A=NetAIN_R1_2 B=DIN2 Y=DO3

### Library data of the parts
AIN_D2 BIN_D2 = IN-S63AT5B: as AIN_D4 on sheet XOR_GATE; Part Number: IN-S63AT5B; Color: Blue; ComponentLink1Description: Datasheet; ComponentLink1URL: http://www.inolux-corp.com/datasheet/SMDLED/Mono%20Color%20Top%20View/IN-S63AT%20Series_V1.1.pdf; ComponentLink2Description: DigiKey Link; ComponentLink2URL: https://www.digikey.com/en/products/detail/inolux/IN-S63AT5B/7604929; Device Package: 0603 (1608 Metric); Height (Max): 0.40mm; LastUpdated: 6/3/2024 7:57:52 PM; Lens Color: Clear; Lens Transparency: Clear; Lifecycle Status: Active; Minimum Order: 1; Mounting Type: Surface Mount; Package / Case: 0603 (1608 Metric); Packaging: TapeAndReel; PartId: 834; Part Status: Active; Price: 0.03; Series: IN-S63AT; Size / Dimension: 1.60mm L x 0.80mm W; Supplier 1: DigiKey; Supplier Part Number 1: 1830-1061-1-ND; Supplier Device Package: 0603; Value: Blue
AIN_Q2 BIN_Q2 Q4 Q5 Y_Q2 = MMSS8050-L-TP: as AIN_Q4 on sheet XOR_GATE; Part Number: MMSS8050-L-TP; ComponentLink1Description: Datasheet; ComponentLink1URL: https://www.mccsemi.com/pdf/Products/MMSS8050(SOT-23).pdf; ComponentLink2Description: DigiKey Link; ComponentLink2URL: https://www.digikey.com/en/products/detail/micro-commercial-co/MMSS8050-L-TP/2827197; Current - Collector (Ic) (Max): 1.5 A; LastUpdated: 6/3/2024 8:24:16 PM; Lifecycle Status: Active; Minimum Order: 1; Mounting Type: Surface Mount; Operating Temperature: -55°C ~ 150°C (TJ); Package / Case: TO-236-3, SC-59, SOT-23-3; Packaging: TapeAndReel; PartId: 278; Part Status: Active; Price: 0.01; Series: -; Supplier 1: DigiKey; Supplier Part Number 1: MMSS8050-L-TPMSCT-ND; Supplier Device Package: SOT-23; Transistor Type: NPN; Voltage - Collector Emitter Breakdown (Max): 25 V
AIN_R2 BIN_R2 R4 R5 Y_R2 = CPF0603B1K0E: as AIN_R4 on sheet XOR_GATE; Part Number: CPF0603B1K0E; Value: 1 kOhms; ComponentLink1Description: Datasheet; ComponentLink1URL: https://www.te.com/commerce/DocumentDelivery/DDEController?Action=srchrtrv&DocNm=1773200&DocType=DS&DocLang=English; ComponentLink2Description: DigiKey Link; ComponentLink2URL: https://www.digikey.com/en/products/detail/te-connectivity-passive-product/CPF0603B1K0E/2390473; Composition: Thin Film; Device Package: 0603 (1608 Metric); Height - Seated (Max): 0.022" (0.55mm); LastUpdated: 2/9/2024 8:43:37 PM; Lifecycle Status: Active; Minimum Order: 1; Number of Terminations: 2; Operating Temperature: -55°C ~ 155°C; Package / Case: 0603 (1608 Metric); Packaging: TapeAndReel; PartId: 4877; Part Status: Active; Price: 0.09; Resistance: 1 kOhms; Series: CPF, Neohm; Size / Dimension: 0.061" L x 0.031" W (1.55mm x 0.80mm); Supplier 1: DigiKey; Supplier Part Number 1: A119887CT-ND; Supplier Device Package: 0603; Tolerance: ±0.1%
AIN_RD2 BIN_RD2 Y_RD2 = RMCF0603JT330R: as AIN_RD4 on sheet XOR_GATE; Part Number: RMCF0603JT330R; Value: 330 Ohms; ComponentLink1Description: Datasheet; ComponentLink1URL: https://www.seielect.com/catalog/sei-rmcf_rmcp.pdf; ComponentLink2Description: DigiKey Link; ComponentLink2URL: https://www.digikey.com/en/products/detail/stackpole-electronics-inc/RMCF0603JT330R/1757998; Composition: Thick Film; Device Package: 0603 (1608 Metric); Features: Automotive AEC-Q200; Height - Seated (Max): 0.022" (0.55mm); LastUpdated: 2/9/2024 8:43:33 PM; Lifecycle Status: Active; Minimum Order: 1; Number of Terminations: 2; Operating Temperature: -55°C ~ 155°C; Package / Case: 0603 (1608 Metric); Packaging: CutTape; PartId: 5841; Part Status: Active; Price: 0.01; Ratings: AEC-Q200; Resistance: 330 Ohms; Series: RMCF; Size / Dimension: 0.061" L x 0.031" W (1.55mm x 0.80mm); Supplier 1: DigiKey; Supplier Part Number 1: RMCF0603JT330RCT-ND; Supplier Device Package: 0603; Tolerance: ±5%
RO2 = ERA-3AED221V: as R10 on sheet XOR_GATE; Part Number: ERA-3AED221V; Value: 220 Ohms; ComponentLink1Description: Datasheet; ComponentLink1URL: https://industrial.panasonic.com/cdbs/www-data/pdf/RDM0000/AOA0000C307.pdf; ComponentLink2Description: DigiKey Link; ComponentLink2URL: https://www.digikey.com/en/products/detail/panasonic-electronic-components/ERA-3AED221V/9373509; Composition: Thin Film; Device Package: 0603 (1608 Metric); Features: Automotive AEC-Q200; Height - Seated (Max): 0.022" (0.55mm); LastUpdated: 2/9/2024 8:43:36 PM; Lifecycle Status: Active; Minimum Order: 1; Number of Terminations: 2; Operating Temperature: -55°C ~ 155°C; Package / Case: 0603 (1608 Metric); Packaging: TapeAndReel; PartId: 4952; Part Status: Active; Price: 0.03; Ratings: AEC-Q200; Resistance: 220 Ohms; Series: ERA-3A; Size / Dimension: 0.063" L x 0.031" W (1.60mm x 0.80mm); Supplier 1: DigiKey; Supplier Part Number 1: P123752CT-ND; Supplier Device Package: 0603; Tolerance: ±0.5%
Y_D2 = XZMDK53W-8: as Y_D4 on sheet XOR_GATE; Part Number: XZMDK53W-8; Color: Red; ComponentLink1Description: Datasheet; ComponentLink1URL: https://www.sunledusa.com/products/spec/XZMDK53W-8.pdf; ComponentLink2Description: DigiKey Link; ComponentLink2URL: https://www.digikey.com/en/products/detail/sunled/XZMDK53W-8/4745952; Device Package: 0603 (1608 Metric); Height (Max): 0.95mm; LastUpdated: 6/3/2024 7:59:48 PM; Lens Transparency: Clear; Lifecycle Status: Active; Minimum Order: 1; Mounting Type: Surface Mount; Package / Case: 0603 (1608 Metric); Packaging: TapeAndReel; PartId: 401; Part Status: Active; Price: 0.06; Series: PixsoLED; Size / Dimension: 1.60mm L x 0.80mm W; Supplier 1: DigiKey; Supplier Part Number 1: 1497-1169-6-ND; Supplier Device Package: Chip LED; Value: Red

## Sheet Sheet1.SchDoc
size C
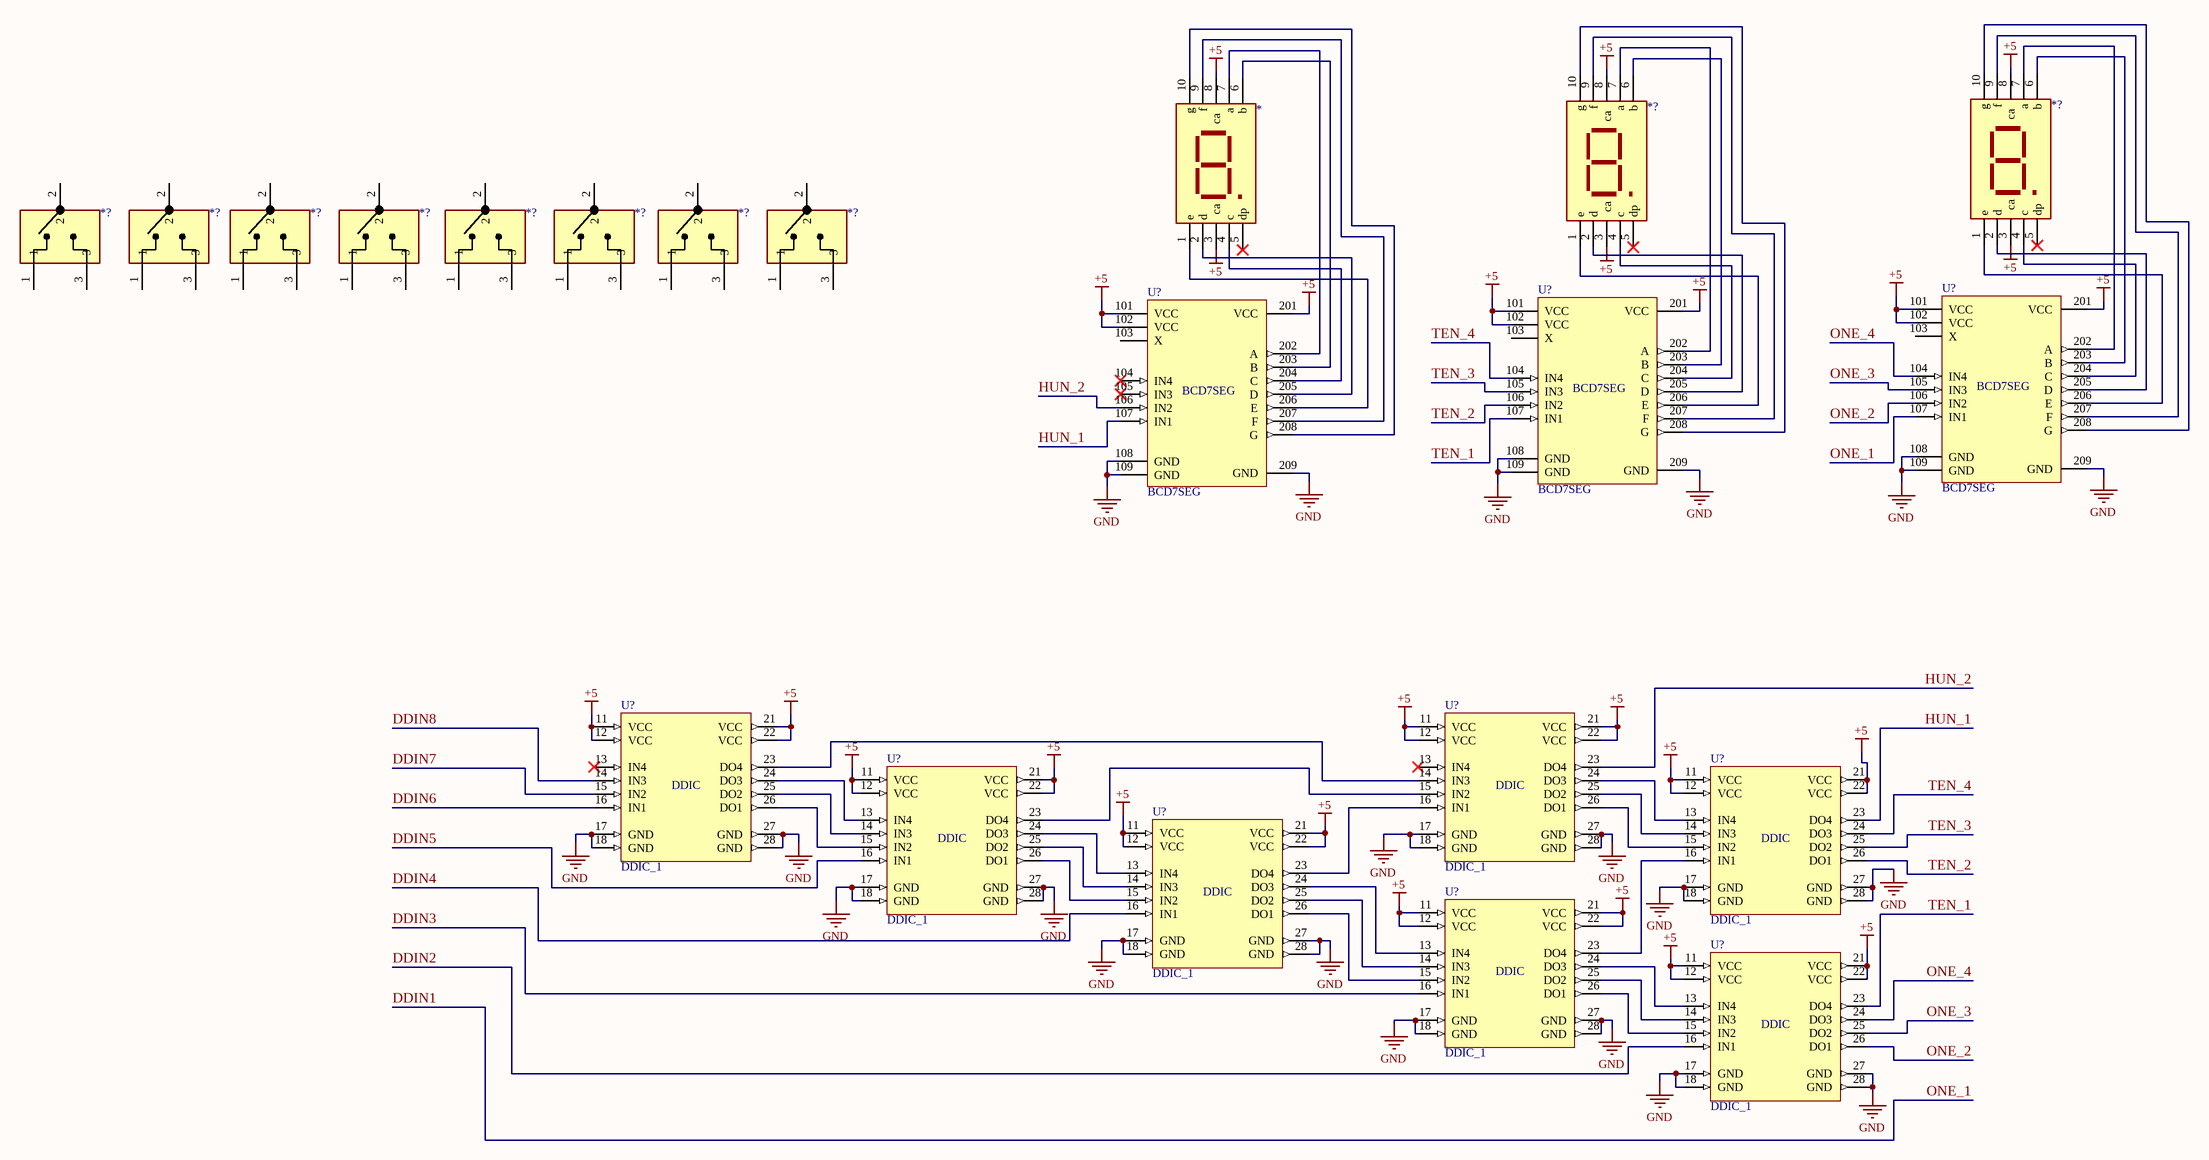
[diagram p5: Sheet1.SchDoc]

### Parts
(Parts that share a designator on the sheet are numbered #1, #2 ... from top to bottom, then left to right.)
*  7SEG_1DIGIT_CA_1INCH  [7SEG_1DIGIT_CA_1INCH]  (value not drawn)
*?#1  7SEG_1DIGIT_CA_1INCH  [7SEG_1DIGIT_CA_1INCH]  (value not drawn)
*?#2  7SEG_1DIGIT_CA_1INCH  [7SEG_1DIGIT_CA_1INCH]  (value not drawn)
*?#3  MTS_102_3P_125V_6A  [MTS_102_3P_125V_6A]  (value not drawn)
*?#4  MTS_102_3P_125V_6A  [MTS_102_3P_125V_6A]  (value not drawn)
*?#5  MTS_102_3P_125V_6A  [MTS_102_3P_125V_6A]  (value not drawn)
*?#6  MTS_102_3P_125V_6A  [MTS_102_3P_125V_6A]  (value not drawn)
*?#7  MTS_102_3P_125V_6A  [MTS_102_3P_125V_6A]  (value not drawn)
*?#8  MTS_102_3P_125V_6A  [MTS_102_3P_125V_6A]  (value not drawn)
*?#9  MTS_102_3P_125V_6A  [MTS_102_3P_125V_6A]  (value not drawn)
*?#10  MTS_102_3P_125V_6A  [MTS_102_3P_125V_6A]  (value not drawn)
U?#1  BCD7SEG  [BCD7SEG]
U?#2  BCD7SEG  [BCD7SEG]
U?#3  BCD7SEG  [BCD7SEG]
U?#4  DDIC_1  [DDIC]
U?#5  DDIC_1  [DDIC]
U?#6  DDIC_1  [DDIC]
U?#7  DDIC_1  [DDIC]
U?#8  DDIC_1  [DDIC]
U?#9  DDIC_1  [DDIC]
U?#10  DDIC_1  [DDIC]

### Nets
+5: *.3(ca) *.8(ca) *?#1.3(ca) *?#1.8(ca) *?#2.3(ca) *?#2.8(ca) U?#1.101(VCC) U?#1.102(VCC) U?#1.201(VCC) U?#2.101(VCC) U?#2.102(VCC) U?#2.201(VCC) U?#3.101(VCC) U?#3.102(VCC) U?#3.201(VCC) U?#4.11(VCC) U?#4.12(VCC) U?#4.21(VCC) U?#4.22(VCC) U?#5.11(VCC) U?#5.12(VCC) U?#5.21(VCC) U?#5.22(VCC) U?#6.11(VCC) U?#6.12(VCC) U?#6.21(VCC) U?#6.22(VCC) U?#7.11(VCC) U?#7.12(VCC) U?#7.21(VCC) U?#7.22(VCC) U?#8.11(VCC) U?#8.12(VCC) U?#8.21(VCC) U?#8.22(VCC) U?#9.11(VCC) U?#9.12(VCC) U?#9.21(VCC) U?#9.22(VCC) U?#10.11(VCC) U?#10.12(VCC) U?#10.21(VCC) U?#10.22(VCC)
GND: U?#1.108(GND) U?#1.109(GND) U?#1.209(GND) U?#2.108(GND) U?#2.109(GND) U?#2.209(GND) U?#3.108(GND) U?#3.109(GND) U?#3.209(GND) U?#4.17(GND) U?#4.18(GND) U?#4.27(GND) U?#4.28(GND) U?#5.17(GND) U?#5.18(GND) U?#5.27(GND) U?#5.28(GND) U?#6.17(GND) U?#6.18(GND) U?#6.27(GND) U?#6.28(GND) U?#7.17(GND) U?#7.18(GND) U?#7.27(GND) U?#7.28(GND) U?#8.17(GND) U?#8.18(GND) U?#8.27(GND) U?#8.28(GND) U?#9.17(GND) U?#9.18(GND) U?#9.27(GND) U?#9.28(GND) U?#10.17(GND) U?#10.18(GND) U?#10.27(GND) U?#10.28(GND)
DDIN1: U?#2.107(IN1)  [also labelled ONE_1]
DDIN2: U?#10.16(IN1)
DDIN3: U?#9.16(IN1)
DDIN4: U?#8.16(IN1)
DDIN5: U?#6.16(IN1)
DDIN6: U?#4.16(IN1)
DDIN7: U?#4.15(IN2)
DDIN8: U?#4.14(IN3)
HUN_1: U?#3.107(IN1) U?#7.23(DO4)
HUN_2: U?#3.106(IN2) U?#5.23(DO4)
ONE_2: U?#2.106(IN2) U?#10.26(DO1)
ONE_3: U?#2.105(IN3) U?#10.25(DO2)
ONE_4: U?#2.104(IN4) U?#10.24(DO3)
TEN_1: U?#1.107(IN1) U?#10.23(DO4)
TEN_2: U?#1.106(IN2) U?#7.26(DO1)
TEN_3: U?#1.105(IN3) U?#7.25(DO2)
TEN_4: U?#1.104(IN4) U?#7.24(DO3)
Net*?#1_1: *?#1.1(e) U?#1.206(E)
Net*?#1_2: *?#1.2(d) U?#1.205(D)
Net*?#1_4: *?#1.4(c) U?#1.204(C)
Net*?#1_6: *?#1.6(b) U?#1.203(B)
Net*?#1_7: *?#1.7(a) U?#1.202(A)
Net*?#1_9: *?#1.9(f) U?#1.207(F)
Net*?#1_10: *?#1.10(g) U?#1.208(G)
Net*?#2_1: *?#2.1(e) U?#2.206(E)
Net*?#2_2: *?#2.2(d) U?#2.205(D)
Net*?#2_4: *?#2.4(c) U?#2.204(C)
Net*?#2_6: *?#2.6(b) U?#2.203(B)
Net*?#2_7: *?#2.7(a) U?#2.202(A)
Net*?#2_9: *?#2.9(f) U?#2.207(F)
Net*?#2_10: *?#2.10(g) U?#2.208(G)
Net*_1: *.1(e) U?#3.206(E)
Net*_2: *.2(d) U?#3.205(D)
Net*_4: *.4(c) U?#3.204(C)
Net*_6: *.6(b) U?#3.203(B)
Net*_7: *.7(a) U?#3.202(A)
Net*_9: *.9(f) U?#3.207(F)
Net*_10: *.10(g) U?#3.208(G)
NetU?#4_23: U?#4.23(DO4) U?#5.14(IN3)
NetU?#4_24: U?#4.24(DO3) U?#6.13(IN4)
NetU?#4_25: U?#4.25(DO2) U?#6.14(IN3)
NetU?#4_26: U?#4.26(DO1) U?#6.15(IN2)
NetU?#5_15: U?#5.15(IN2) U?#6.23(DO4)
NetU?#5_16: U?#5.16(IN1) U?#8.23(DO4)
NetU?#5_24: U?#5.24(DO3) U?#7.13(IN4)
NetU?#5_25: U?#5.25(DO2) U?#7.14(IN3)
NetU?#5_26: U?#5.26(DO1) U?#7.15(IN2)
NetU?#6_24: U?#6.24(DO3) U?#8.13(IN4)
NetU?#6_25: U?#6.25(DO2) U?#8.14(IN3)
NetU?#6_26: U?#6.26(DO1) U?#8.15(IN2)
NetU?#7_16: U?#7.16(IN1) U?#9.23(DO4)
NetU?#8_24: U?#8.24(DO3) U?#9.13(IN4)
NetU?#8_25: U?#8.25(DO2) U?#9.14(IN3)
NetU?#8_26: U?#8.26(DO1) U?#9.15(IN2)
NetU?#9_24: U?#9.24(DO3) U?#10.13(IN4)
NetU?#9_25: U?#9.25(DO2) U?#10.14(IN3)
NetU?#9_26: U?#9.26(DO1) U?#10.15(IN2)

Not connected (* = marked no-connect by the designer): * 5(dp)*; *?#1 5(dp)*; *?#2 5(dp)*; *?#3 1 2 3; *?#4 1 2 3; *?#5 1 2 3; *?#6 1 2 3; *?#7 1 2 3; *?#8 1 2 3; *?#9 1 2 3; *?#10 1 2 3; U?#1 103(X); U?#2 103(X); U?#3 103(X) 104(IN4)* 105(IN3)*; U?#4 13(IN4)*; U?#5 13(IN4)*

### Notes on the sheet
- (in symbol DDIC_1) DDIC

## Nets that join several sheets
+5: MODULE_1 (IN.1 IN.2 OUT.1 OUT.2), U_XOR_GATE_02 (7 pins), OR_GATE (5 pins), AND_GATE (5 pins), U_NOR_GATE_01 (AIN_RD2_U_NOR_GATE_01.1 BIN_RD2_U_NOR_GATE_01.1 RO2_U_NOR_GATE_01.2 Y_RD2_U_NOR_GATE_01.1), U_XOR_GATE_00 (7 pins), U_NOR_GATE_10 (AIN_RD2_U_NOR_GATE_10.1 BIN_RD2_U_NOR_GATE_10.1 RO2_U_NOR_GATE_10.2 Y_RD2_U_NOR_GATE_10.1), U_NOR_GATE_20 (AIN_RD2_U_NOR_GATE_20.1 BIN_RD2_U_NOR_GATE_20.1 RO2_U_NOR_GATE_20.2 Y_RD2_U_NOR_GATE_20.1), U_NOR_GATE_30 (AIN_RD2_U_NOR_GATE_30.1 BIN_RD2_U_NOR_GATE_30.1 RO2_U_NOR_GATE_30.2 Y_RD2_U_NOR_GATE_30.1), U_XOR_GATE_32 (7 pins), Sheet1 (43 pins)
GND: MODULE_1 (IN.7 IN.8 OUT.7 OUT.8), U_XOR_GATE_02 (6 pins), OR_GATE (6 pins), AND_GATE (5 pins), U_NOR_GATE_01 (5 pins), U_XOR_GATE_00 (6 pins), U_NOR_GATE_10 (5 pins), U_NOR_GATE_20 (5 pins), U_NOR_GATE_30 (5 pins), U_XOR_GATE_32 (6 pins), Sheet1 (37 pins)
DIN1: MODULE_1 (IN.6), U_XOR_GATE_00 (AIN_R4_U_XOR_GATE_00.2 R15_U_XOR_GATE_00.1), U_XOR_GATE_32 (BIN_R4_U_XOR_GATE_32.2 R16_U_XOR_GATE_32.1)
DIN2: MODULE_1 (IN.5), U_XOR_GATE_02 (BIN_R4_U_XOR_GATE_02.2 R16_U_XOR_GATE_02.1), U_NOR_GATE_30 (BIN_R2_U_NOR_GATE_30.2 R5_U_NOR_GATE_30.1)
DIN3: MODULE_1 (IN.4), U_NOR_GATE_01 (BIN_R2_U_NOR_GATE_01.2 R5_U_NOR_GATE_01.1)
DIN4: MODULE_1 (IN.3), U_XOR_GATE_02 (AIN_R4_U_XOR_GATE_02.2 R15_U_XOR_GATE_02.1), U_NOR_GATE_01 (AIN_R2_U_NOR_GATE_01.2 R4_U_NOR_GATE_01.1), U_XOR_GATE_00 (BIN_R4_U_XOR_GATE_00.2 R16_U_XOR_GATE_00.1)
DO1: MODULE_1 (OUT.6), U_XOR_GATE_32 (Q12_U_XOR_GATE_32.3 R10_U_XOR_GATE_32.1 Y_R4_U_XOR_GATE_32.2)
DO2: MODULE_1 (OUT.5), AND_GATE (Q2.3 RO1.1 Y_R1.2)
DO3: MODULE_1 (OUT.4), U_NOR_GATE_30 (Q4_U_NOR_GATE_30.3 Q5_U_NOR_GATE_30.3 RO2_U_NOR_GATE_30.1 Y_R2_U_NOR_GATE_30.2)
DO4: MODULE_1 (OUT.3), U_NOR_GATE_20 (Q4_U_NOR_GATE_20.3 Q5_U_NOR_GATE_20.3 RO2_U_NOR_GATE_20.1 Y_R2_U_NOR_GATE_20.2), U_XOR_GATE_32 (AIN_R4_U_XOR_GATE_32.2 R15_U_XOR_GATE_32.1)
NetAIN_R1_2: OR_GATE (Q7.3 RO3.1 Y_R3.2), AND_GATE (AIN_R1.2 R2.1), U_NOR_GATE_30 (AIN_R2_U_NOR_GATE_30.2 R4_U_NOR_GATE_30.1)
NetAIN_R2_U_NOR_GATE_10_2: OR_GATE (BIN_R3.2 R8.1), U_XOR_GATE_00 (Q12_U_XOR_GATE_00.3 R10_U_XOR_GATE_00.1 Y_R4_U_XOR_GATE_00.2), U_NOR_GATE_10 (AIN_R2_U_NOR_GATE_10.2 R4_U_NOR_GATE_10.1)
NetAIN_R2_U_NOR_GATE_20_2: U_NOR_GATE_10 (Q4_U_NOR_GATE_10.3 Q5_U_NOR_GATE_10.3 RO2_U_NOR_GATE_10.1 Y_R2_U_NOR_GATE_10.2), U_NOR_GATE_20 (AIN_R2_U_NOR_GATE_20.2 R4_U_NOR_GATE_20.1)
NetAIN_R3_2: OR_GATE (AIN_R3.2 R6.1), U_NOR_GATE_01 (Q4_U_NOR_GATE_01.3 Q5_U_NOR_GATE_01.3 RO2_U_NOR_GATE_01.1 Y_R2_U_NOR_GATE_01.2), U_NOR_GATE_20 (BIN_R2_U_NOR_GATE_20.2 R5_U_NOR_GATE_20.1)
NetBIN_R1_2: U_XOR_GATE_02 (Q12_U_XOR_GATE_02.3 R10_U_XOR_GATE_02.1 Y_R4_U_XOR_GATE_02.2), AND_GATE (BIN_R1.2 R3.1), U_NOR_GATE_10 (BIN_R2_U_NOR_GATE_10.2 R5_U_NOR_GATE_10.1)